# Altium schematic sheet DDR3 Terminations and Decoupling.SchDoc
size A4
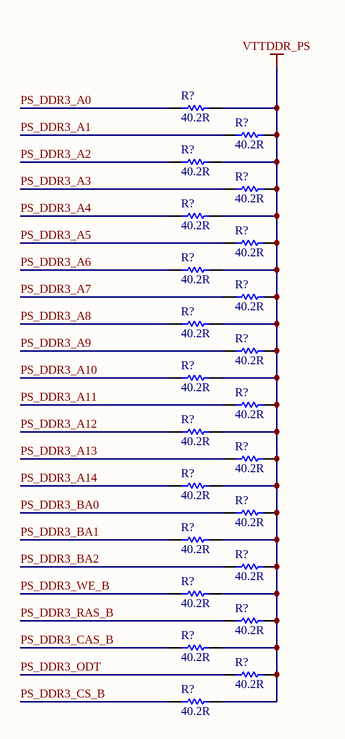
[diagram p0: DDR3 Terminations and Decoupling.SchDoc]

## Parts
(Parts that share a designator on the sheet are numbered #1, #2 ... from top to bottom, then left to right.)
R?#1  40.2R  [RESC1005X40X25ML05T10]
R?#2  40.2R  [RESC1005X40X25ML05T10]
R?#3  40.2R  [RESC1005X40X25ML05T10]
R?#4  40.2R  [RESC1005X40X25ML05T10]
R?#5  40.2R  [RESC1005X40X25ML05T10]
R?#6  40.2R  [RESC1005X40X25ML05T10]
R?#7  40.2R  [RESC1005X40X25ML05T10]
R?#8  40.2R  [RESC1005X40X25ML05T10]
R?#9  40.2R  [RESC1005X40X25ML05T10]
R?#10  40.2R  [RESC1005X40X25ML05T10]
R?#11  40.2R  [RESC1005X40X25ML05T10]
R?#12  40.2R  [RESC1005X40X25ML05T10]
R?#13  40.2R  [RESC1005X40X25ML05T10]
R?#14  40.2R  [RESC1005X40X25ML05T10]
R?#15  40.2R  [RESC1005X40X25ML05T10]
R?#16  40.2R  [RESC1005X40X25ML05T10]
R?#17  40.2R  [RESC1005X40X25ML05T10]
R?#18  40.2R  [RESC1005X40X25ML05T10]
R?#19  40.2R  [RESC1005X40X25ML05T10]
R?#20  40.2R  [RESC1005X40X25ML05T10]
R?#21  40.2R  [RESC1005X40X25ML05T10]
R?#22  40.2R  [RESC1005X40X25ML05T10]
R?#23  40.2R  [RESC1005X40X25ML05T10]

## Nets
VTTDDR_PS: R?#1.2 R?#2.2 R?#3.2 R?#4.2 R?#5.2 R?#6.2 R?#7.2 R?#8.2 R?#9.2 R?#10.2 R?#11.2 R?#12.2 R?#13.2 R?#14.2 R?#15.2 R?#16.2 R?#17.2 R?#18.2 R?#19.2 R?#20.2 R?#21.2 R?#22.2 R?#23.2
PS_DDR3_A0: R?#1.1
PS_DDR3_A1: R?#2.1
PS_DDR3_A2: R?#3.1
PS_DDR3_A3: R?#4.1
PS_DDR3_A4: R?#5.1
PS_DDR3_A5: R?#6.1
PS_DDR3_A6: R?#7.1
PS_DDR3_A7: R?#8.1
PS_DDR3_A8: R?#9.1
PS_DDR3_A9: R?#10.1
PS_DDR3_A10: R?#11.1
PS_DDR3_A11: R?#12.1
PS_DDR3_A12: R?#13.1
PS_DDR3_A13: R?#14.1
PS_DDR3_A14: R?#15.1
PS_DDR3_BA0: R?#16.1
PS_DDR3_BA1: R?#17.1
PS_DDR3_BA2: R?#18.1
PS_DDR3_CAS_B: R?#21.1
PS_DDR3_CS_B: R?#23.1
PS_DDR3_ODT: R?#22.1
PS_DDR3_RAS_B: R?#20.1
PS_DDR3_WE_B: R?#19.1

## Notes on the sheet
- Title
- Size:
- Date:
- A3
- Drawn by:
- Time:
- Revision:
- Sheet
- of
- File:

## Library data of the parts
R?#1-R?#23 = CMP-2002-07675-1: 40.2 ohm 1% 0402; Part Number: RC0402FR-07402RL; Manufacturer: Yageo